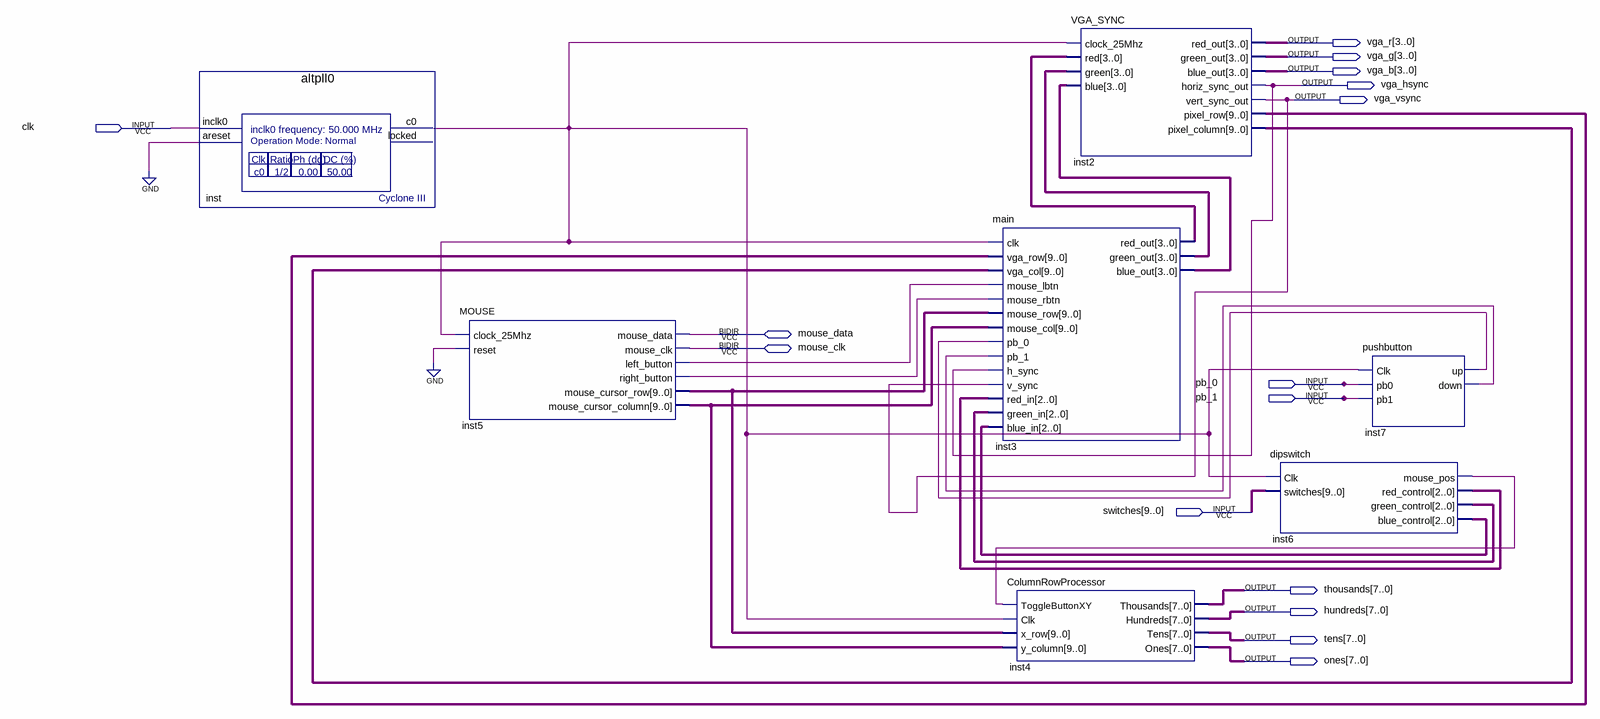
[diagram p0: schematic sheet]
// Quartus schematic toplevel.bdf as structural Verilog: 7 symbols, 15 pins
module toplevel (
  input  clk,
  input  pb_0,
  input  pb_1,
  input  [9:0] switches,
  inout  mouse_data,
  inout  mouse_clk,
  output [3:0] vga_r,
  output [3:0] vga_g,
  output [3:0] vga_b,
  output vga_hsync,
  output vga_vsync,
  output [7:0] thousands,
  output [7:0] hundreds,
  output [7:0] tens,
  output [7:0] ones
);

  wire inst5_left_button, inst5_right_button, inst6_mouse_pos, inst7_down, inst7_up, inst_c0;
  wire [2:0] inst6_blue_control, inst6_green_control, inst6_red_control;
  wire [3:0] inst3_blue_out, inst3_green_out, inst3_red_out;
  wire [9:0] inst2_pixel_column, inst2_pixel_row, inst5_mouse_cursor_column, inst5_mouse_cursor_row;

  altpll0 inst (.inclk0(clk), .areset(1'b0), .c0(inst_c0));  // open: locked
  MOUSE inst5 (
    .clock_25Mhz(inst_c0), .reset(1'b0), .left_button(inst5_left_button), .right_button(inst5_right_button),
    .mouse_cursor_row(inst5_mouse_cursor_row), .mouse_cursor_column(inst5_mouse_cursor_column),
    .mouse_data(mouse_data), .mouse_clk(mouse_clk));
  main inst3 (
    .clk(inst_c0), .vga_row(inst2_pixel_row), .vga_col(inst2_pixel_column), .mouse_lbtn(inst5_left_button),
    .mouse_rbtn(inst5_right_button), .mouse_row(inst5_mouse_cursor_row),
    .mouse_col(inst5_mouse_cursor_column), .pb_0(inst7_up), .pb_1(inst7_down), .h_sync(vga_hsync),
    .v_sync(vga_vsync), .red_in(inst6_red_control), .green_in(inst6_green_control),
    .blue_in(inst6_blue_control), .red_out(inst3_red_out), .green_out(inst3_green_out),
    .blue_out(inst3_blue_out));
  ColumnRowProcessor inst4 (
    .ToggleButtonXY(inst6_mouse_pos), .Clk(inst_c0), .x_row(inst5_mouse_cursor_row),
    .y_column(inst5_mouse_cursor_column), .Thousands(thousands), .Hundreds(hundreds), .Tens(tens), .Ones(ones));
  VGA_SYNC inst2 (
    .clock_25Mhz(inst_c0), .red(inst3_red_out), .green(inst3_green_out), .blue(inst3_blue_out),
    .red_out(vga_r), .green_out(vga_g), .blue_out(vga_b), .horiz_sync_out(vga_hsync),
    .vert_sync_out(vga_vsync), .pixel_row(inst2_pixel_row), .pixel_column(inst2_pixel_column));
  dipswitch inst6 (
    .Clk(inst_c0), .switches(switches), .mouse_pos(inst6_mouse_pos), .red_control(inst6_red_control),
    .green_control(inst6_green_control), .blue_control(inst6_blue_control));
  pushbutton inst7 (.Clk(inst_c0), .pb0(pb_0), .pb1(pb_1), .up(inst7_up), .down(inst7_down));
endmodule
